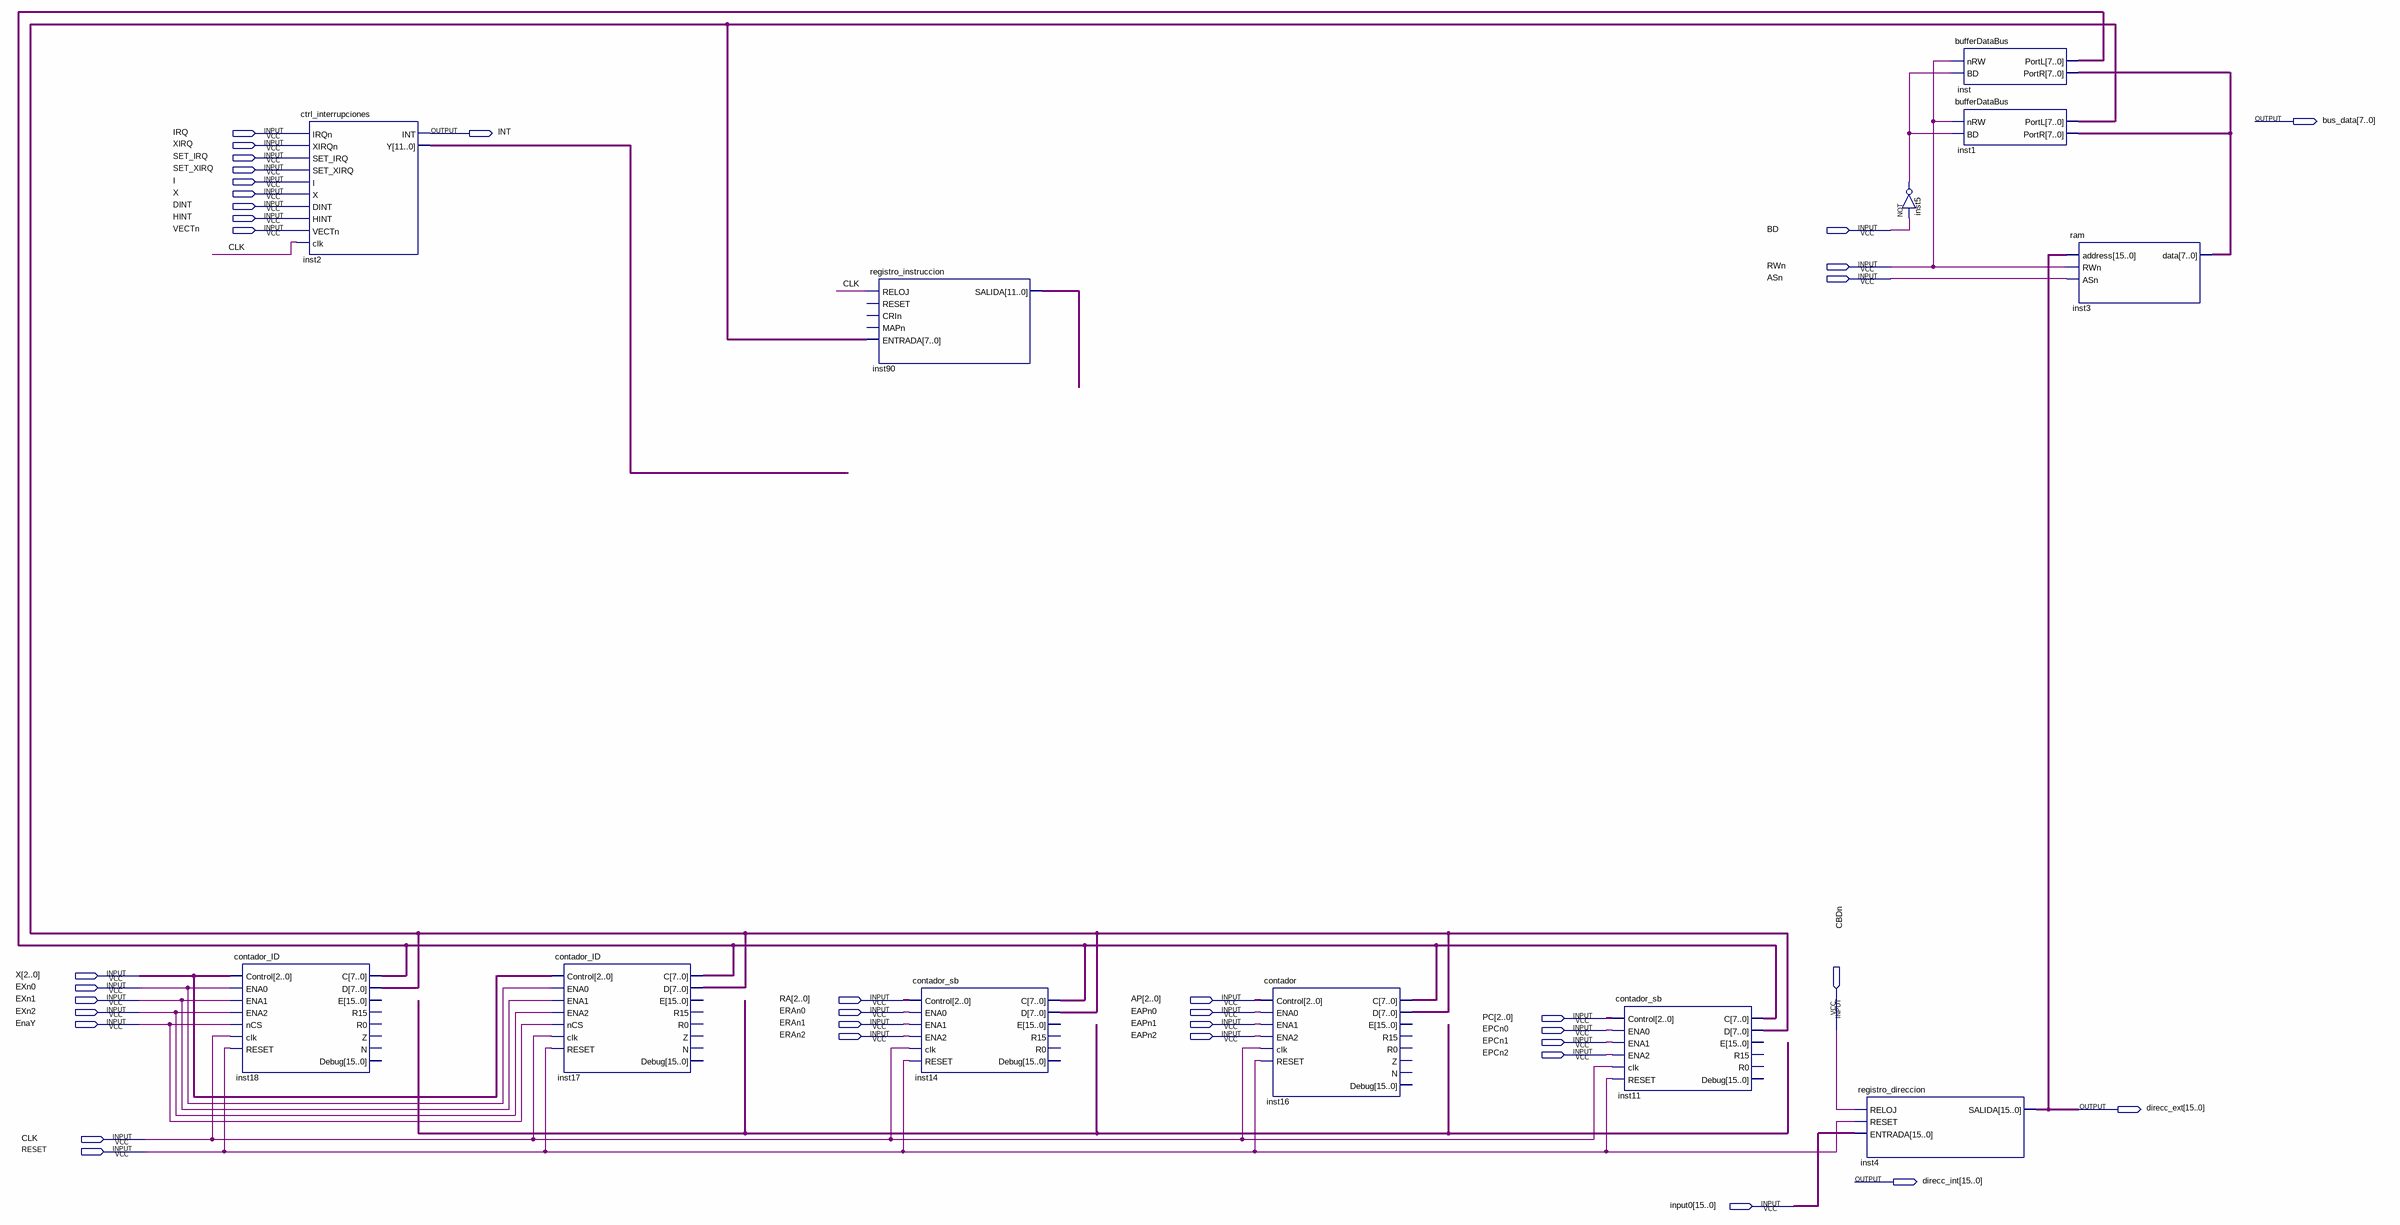
[diagram p0: schematic sheet]
// Quartus schematic arquitectura.bdf as structural Verilog: 12 symbols, 37 pins
module arquitectura (
  input  IRQ,
  input  XIRQ,
  input  SET_IRQ,
  input  SET_XIRQ,
  input  I,
  input  X_1bit,
  input  DINT,
  input  HINT,
  input  VECTn,
  input  BD,
  input  RWn,
  input  ASn,
  input  [2:0] X,
  input  EXn0,
  input  EXn1,
  input  [2:0] RA,
  input  [2:0] AP,
  input  EXn2,
  input  ERAn0,
  input  EAPn0,
  input  [2:0] PC,
  input  EnaY,
  input  ERAn1,
  input  EAPn1,
  input  EPCn0,
  input  CBDn,
  input  ERAn2,
  input  EAPn2,
  input  EPCn1,
  input  EPCn2,
  input  CLK,
  input  RESET,
  input  [15:0] input0,
  output [7:0] bus_data,
  output INT,
  output [15:0] direcc_ext,
  output [15:0] direcc_int
);

  wire inst5_out;
  wire [7:0] inst18_c, inst18_d, inst_portr;
  wire [11:0] inst2_y, inst90_salida;

  contador_ID inst18 (
    .Control(X), .ENA0(EXn0), .ENA1(EXn1), .ENA2(EXn2), .nCS(EnaY), .clk(CLK), .RESET(RESET), .C(inst18_c),
    .D(inst18_d));  // open: E, Z, N, Debug, R15, R0
  ctrl_interrupciones inst2 (
    .IRQn(IRQ), .XIRQn(XIRQ), .SET_IRQ(SET_IRQ), .SET_XIRQ(SET_XIRQ), .I(I), .X(X_1bit), .DINT(DINT),
    .HINT(HINT), .VECTn(VECTn), .clk(CLK), .INT(INT), .Y(inst2_y));
  contador_ID inst17 (
    .Control(X), .ENA0(EXn0), .ENA1(EXn1), .ENA2(EXn2), .nCS(EnaY), .clk(CLK), .RESET(RESET), .C(inst18_c),
    .D(inst18_d));  // open: E, Z, N, Debug, R15, R0
  registro_instruccion inst90 (.RELOJ(CLK), .ENTRADA(inst18_d), .SALIDA(inst90_salida));  // open: RESET, CRIn, MAPn
  contador_sb inst14 (
    .Control(RA), .ENA0(ERAn0), .ENA1(ERAn1), .ENA2(ERAn2), .clk(CLK), .RESET(RESET), .C(inst18_c),
    .D(inst18_d));  // open: E, Debug, R15, R0
  contador inst16 (
    .Control(AP), .ENA0(EAPn0), .ENA1(EAPn1), .ENA2(EAPn2), .clk(CLK), .RESET(RESET), .C(inst18_c),
    .D(inst18_d));  // open: E, Z, N, Debug, R15, R0
  contador_sb inst11 (
    .Control(PC), .ENA0(EPCn0), .ENA1(EPCn1), .ENA2(EPCn2), .clk(CLK), .RESET(RESET), .C(inst18_c),
    .D(inst18_d));  // open: E, Debug, R15, R0
  registro_direccion inst4 (.RELOJ(CBDn), .RESET(RESET), .ENTRADA(input0), .SALIDA(direcc_ext));
  not inst5 (inst5_out, BD);
  bufferDataBus inst (.nRW(RWn), .BD(inst5_out), .PortL(inst18_c), .PortR(inst_portr));
  bufferDataBus inst1 (.nRW(RWn), .BD(inst5_out), .PortL(inst18_d), .PortR(inst_portr));
  ram inst3 (.address(direcc_ext), .RWn(RWn), .ASn(ASn), .data(inst_portr));
endmodule
